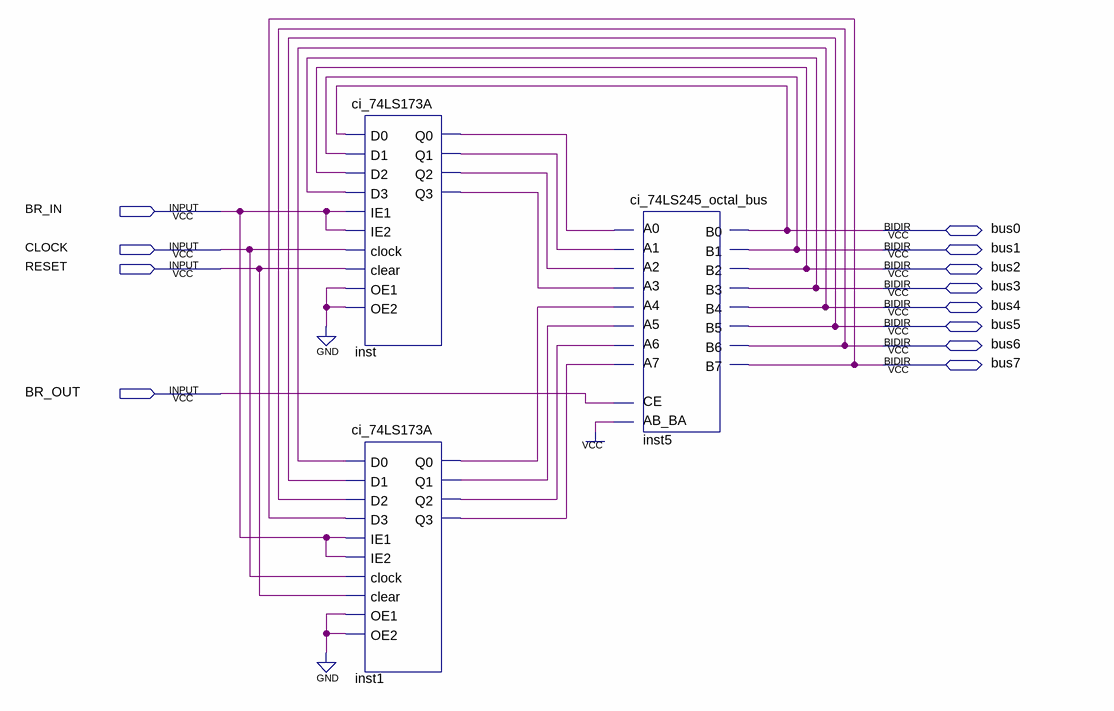
[diagram p0: schematic sheet]
// Quartus schematic cp_b_register.bdf as structural Verilog: 3 symbols, 12 pins
module cp_b_register (
  input  BR_IN,
  input  CLOCK,
  input  RESET,
  input  BR_OUT,
  inout  bus0,
  inout  bus1,
  inout  bus2,
  inout  bus3,
  inout  bus4,
  inout  bus5,
  inout  bus6,
  inout  bus7
);

  wire inst1_q0, inst1_q1, inst1_q2, inst1_q3, inst5_ab_ba, inst_q0, inst_q1, inst_q2, inst_q3;

  ci_74LS173A inst (
    .D0(bus0), .D1(bus1), .D2(bus2), .D3(bus3), .IE1(BR_IN), .IE2(BR_IN), .clock(CLOCK), .clear(RESET),
    .OE1(1'b0), .OE2(1'b0), .Q0(inst_q0), .Q1(inst_q1), .Q2(inst_q2), .Q3(inst_q3));
  ci_74LS173A inst1 (
    .D0(bus4), .D1(bus5), .D2(bus6), .D3(bus7), .IE1(BR_IN), .IE2(BR_IN), .clock(CLOCK), .clear(RESET),
    .OE1(1'b0), .OE2(1'b0), .Q0(inst1_q0), .Q1(inst1_q1), .Q2(inst1_q2), .Q3(inst1_q3));
  ci_74LS245_octal_bus inst5 (
    .B0(bus0), .B1(bus1), .B2(bus2), .B3(bus3), .B4(bus4), .B5(bus5), .B6(bus6), .B7(bus7), .CE(BR_OUT),
    .A0(inst_q0), .A1(inst_q1), .A2(inst_q2), .A3(inst_q3), .A4(inst1_q0), .A5(inst1_q1), .A6(inst1_q2),
    .A7(inst1_q3), .AB_BA(inst5_ab_ba));
  // also tied to VCC on the sheet: inst5_ab_ba
endmodule
